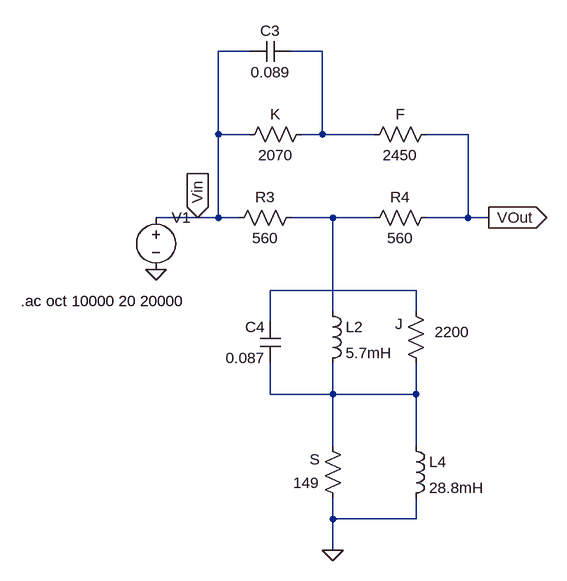
[diagram p0: schematic LoCutHiBoost.asc]
LoCutHiBoost.asc, the LTspice schematic file:
Version 4
SHEET 1 880 832
WIRE 224 48 176 48
WIRE 336 48 288 48
WIRE 176 176 176 48
WIRE 224 176 176 176
WIRE 336 176 336 48
WIRE 336 176 304 176
WIRE 416 176 336 176
WIRE 560 176 496 176
WIRE 144 304 80 304
WIRE 176 304 176 176
WIRE 176 304 144 304
WIRE 208 304 176 304
WIRE 352 304 288 304
WIRE 416 304 352 304
WIRE 560 304 560 176
WIRE 560 304 496 304
WIRE 592 304 560 304
WIRE 480 416 256 416
WIRE 352 448 352 304
WIRE 480 448 480 416
WIRE 256 464 256 416
WIRE 256 576 256 528
WIRE 352 576 352 528
WIRE 352 576 256 576
WIRE 480 576 480 528
WIRE 480 576 352 576
WIRE 352 656 352 576
WIRE 480 656 480 576
WIRE 352 768 352 736
WIRE 480 768 480 736
WIRE 480 768 352 768
WIRE 352 816 352 768
FLAG 352 816 0
FLAG 80 384 0
FLAG 592 304 VOut
IOPIN 592 304 Out
FLAG 144 304 Vin
IOPIN 144 304 In
SYMBOL Cap 288 32 R90
WINDOW 0 0 32 VBottom 2
WINDOW 3 32 32 VTop 2
SYMATTR InstName C3
SYMATTR Value 0.089
SYMBOL Cap 272 528 R180
WINDOW 0 24 56 Left 2
WINDOW 3 24 8 Left 2
SYMATTR InstName C4
SYMATTR Value 0.087
SYMBOL Res 320 160 R90
WINDOW 0 0 56 VBottom 2
WINDOW 3 32 56 VTop 2
SYMATTR InstName K
SYMATTR Value 2070
SYMBOL Res 512 160 R90
WINDOW 0 0 56 VBottom 2
WINDOW 3 32 56 VTop 2
SYMATTR InstName F
SYMATTR Value 2450
SYMBOL Res 304 288 R90
WINDOW 0 0 56 VBottom 2
WINDOW 3 32 56 VTop 2
SYMATTR InstName R3
SYMATTR Value 560
SYMBOL Res 512 288 R90
WINDOW 0 0 56 VBottom 2
WINDOW 3 32 56 VTop 2
SYMATTR InstName R4
SYMATTR Value 560
SYMBOL Res 496 544 R180
WINDOW 0 36 76 Left 2
WINDOW 3 -67 64 Left 2
SYMATTR InstName J
SYMATTR Value 2200
SYMBOL Res 368 752 R180
WINDOW 0 36 76 Left 2
WINDOW 3 36 40 Left 2
SYMATTR InstName S
SYMATTR Value 149
SYMBOL ind 336 432 R0
SYMATTR InstName L2
SYMATTR Value 5.7mH
SYMATTR SpiceLine Rser=2.71
SYMBOL ind 464 640 R0
SYMATTR InstName L4
SYMATTR Value 28.8mH
SYMATTR SpiceLine Rser=5.37
SYMBOL Voltage 80 288 R0
SYMATTR InstName V1
SYMATTR Value ""
SYMATTR Value2 AC 1
TEXT -128 432 Left 2 !.ac oct 10000 20 20000

The netlist it stands for:
* LoCutHiBoost.asc
C3 N001 Vin 0.089
C4 N004 N003 0.087
R§K N001 Vin 2070
R§F VOut N001 2450
R3 N002 Vin 560
R4 VOut N002 560
R§J N004 N003 2200
R§S 0 N004 149
L2 N002 N004 5.7mH Rser=2.71
L4 N004 0 28.8mH Rser=5.37
V1 Vin 0 AC 1
.ac oct 10000 20 20000
.backanno
.end